# Altium schematic sheet Connectors.SchDoc
size A4; DocumentNumber: 3; SheetNumber: 3; SheetTotal: 7
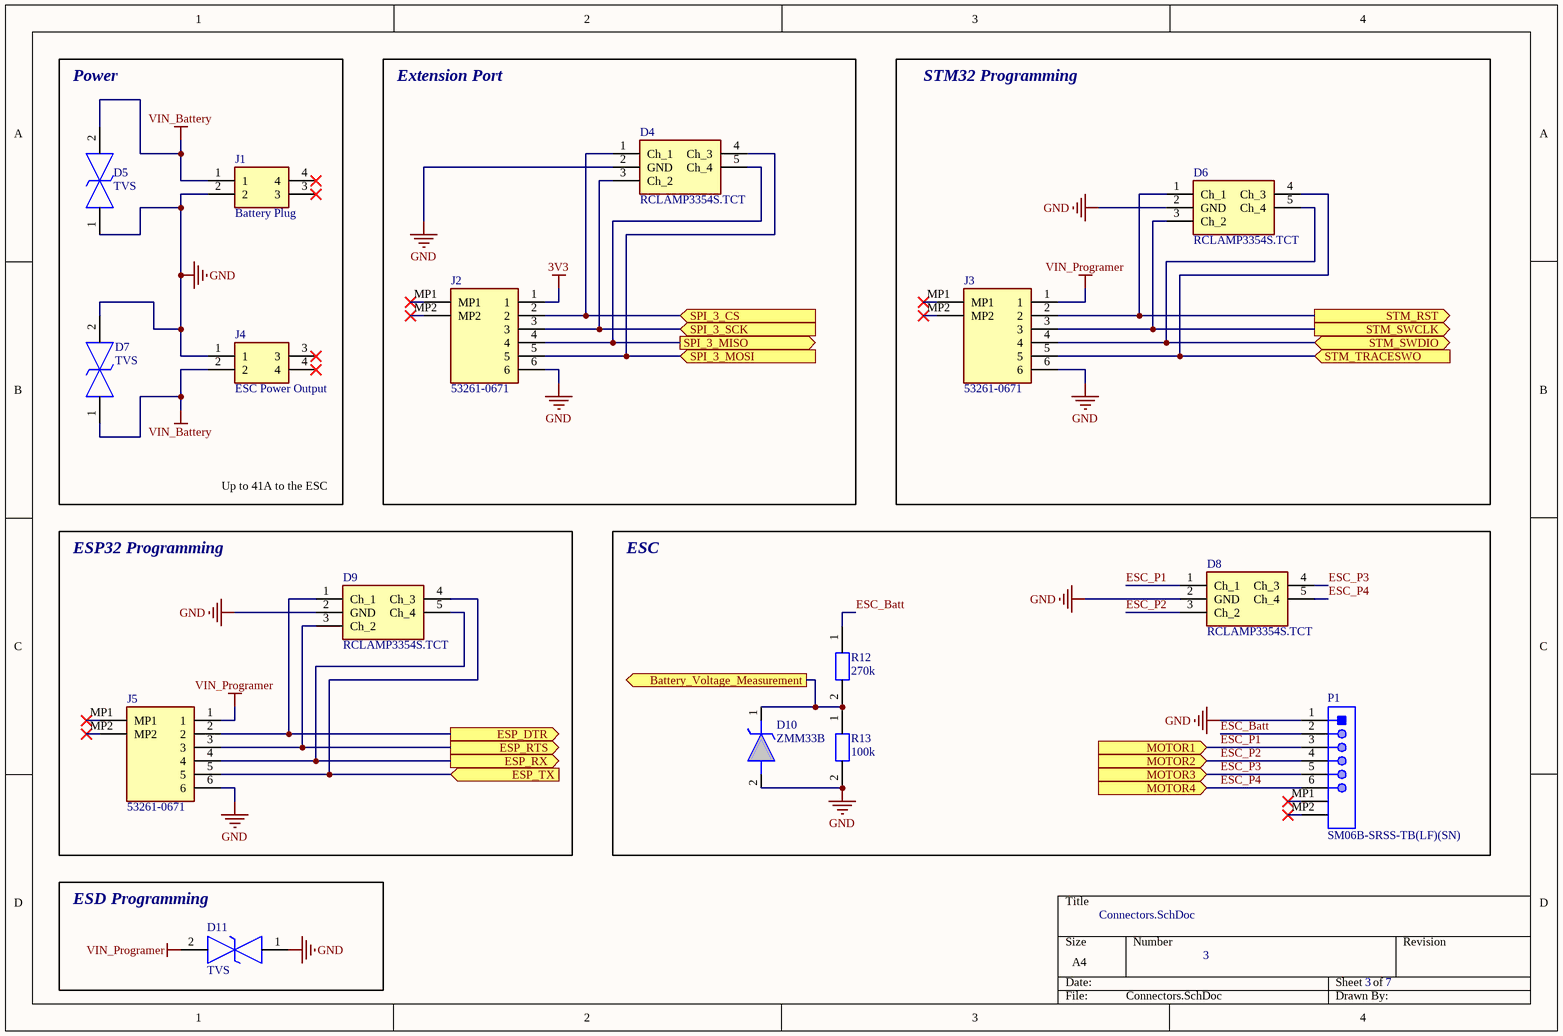
[diagram p0: Connectors.SchDoc]

## Parts
D4  RCLAMP3354S.TCT  [SOT95P280X145-5N]
D5  TVS  [DIONM5127X250N]
D6  RCLAMP3354S.TCT  [SOT95P280X145-5N]
D7  TVS  [DIONM5127X250N]
D8  RCLAMP3354S.TCT  [SOT95P280X145-5N]
D9  RCLAMP3354S.TCT  [SOT95P280X145-5N]
D10  ZMM33B  [ZMM33B]
D11  TVS  [AQ120501LTG]
J1  Battery Plug  [XT30PWM]
J2  53261-0671  [532610671]
J3  53261-0671  [532610671]
J4  ESC Power Output  [XT30PWF]
J5  53261-0671  [532610671]
P1  SM06B-SRSS-TB(LF)(SN)  [JST-SM06B-SRSS-TB_V]
R12  270k  [Res_0603_Medium_Density]
R13  100k  [Res_0603_Medium_Density]

## Blocks framed on the sheet
Power: D5 D7 J1 J4
Extension Port: D4 J2
STM32 Programming: D6 J3
ESP32 Programming: D9 J5
ESC: D8 D10 P1 R12 R13
ESD Programming: D11

## Ports
Battery_Voltage_Measurement (out), ESP_DTR (out), ESP_RTS (out), ESP_RX (out), ESP_TX (in), MOTOR1 (in), MOTOR2 (in), MOTOR3 (in), MOTOR4 (in), SPI_3_CS (in), SPI_3_MISO (out), SPI_3_MOSI (in), SPI_3_SCK (in), STM_RST (out), STM_SWCLK (out), STM_SWDIO (bidir), STM_TRACESWO (in)

## Nets
3V3: J2.1
GND: D4.2(GND) D5.1 D6.2(GND) D7.2 D8.2(GND) D9.2(GND) D10.2(A) D11.1 J1.2 J2.6 J3.6 J4.1 J5.6 P1.1 R13.2
VIN_Battery: D5.2 D7.1 J1.1 J4.2
VIN_Programer: D11.2 J3.1 J5.1
Battery_Voltage_Measurement: D10.1(K) R12.2 R13.1 ; port Battery_Voltage_Measurement
ESC_Batt: P1.2 R12.1
ESC_P1: D8.1(Ch_1) P1.3 ; port MOTOR1
ESC_P2: D8.3(Ch_2) P1.4 ; port MOTOR2
ESC_P3: D8.4(Ch_3) P1.5 ; port MOTOR3
ESC_P4: D8.5(Ch_4) P1.6 ; port MOTOR4
ESP_DTR: D9.1(Ch_1) J5.2 ; port ESP_DTR
ESP_RTS: D9.3(Ch_2) J5.3 ; port ESP_RTS
ESP_RX: D9.5(Ch_4) J5.4 ; port ESP_RX
ESP_TX: D9.4(Ch_3) J5.5 ; port ESP_TX
SPI_3_CS: D4.1(Ch_1) J2.2 ; port SPI_3_CS
SPI_3_MISO: D4.5(Ch_4) J2.4 ; port SPI_3_MISO
SPI_3_MOSI: D4.4(Ch_3) J2.5 ; port SPI_3_MOSI
SPI_3_SCK: D4.3(Ch_2) J2.3 ; port SPI_3_SCK
STM_RST: D6.1(Ch_1) J3.2 ; port STM_RST
STM_SWCLK: D6.3(Ch_2) J3.3 ; port STM_SWCLK
STM_SWDIO: D6.5(Ch_4) J3.4 ; port STM_SWDIO
STM_TRACESWO: D6.4(Ch_3) J3.5 ; port STM_TRACESWO

Not connected (* = marked no-connect by the designer): J1 3* 4*; J2 MP1* MP2*; J3 MP1* MP2*; J4 3* 4*; J5 MP1* MP2*; P1 MP1* MP2*

## Notes on the sheet
- Up to 41A to the ESC

## Library data of the parts
D4 D6 D8 D9 = RCLAMP3354S.TCT: ESD Suppressors / TVS Diodes 3.3V 4 LINE LOW CAP; Manufacturer_Name: SEMTECH; Geometry.Height: 1.45mm; Manufacturer_Part_Number: RCLAMP3354S.TCT; Mouser Part Number: 947-RCLAMP3354S.TCT; Mouser Price/Stock: https://www.mouser.co.uk/ProductDetail/Semtech/RCLAMP3354S.TCT?qs=rBWM4%252BvDhIcjyMg1J9MbMw%3D%3D; Datasheet Link: https://semtech.my.salesforce.com/sfc/p/#E0000000JelG/a/44000000MCrm/q3IJaquvh9BkANCL4E8HYT8vxS.k3jwPHRhsWr6XNsI; Part Number: RCLAMP3354S.TCT; Supplier: Mouser
D5 D7 = SMAJ12CA-HP6AT_13: 19.9V Clamp 30.2A Ipp Tvs Diode Surface Mount DO-214AC (SMA); Manufacturer_Name: YAGEO; Manufacturer_Part_Number: SMAJ12CA-HP6AT/13; Geometry.Height: 2.5mm; Mouser Part Number: *; Mouser Price/Stock: *; Datasheet Link: https://www.yageo.com/upload/media/product/productsearch/datasheet/cpc/tvs/SMAJ-HP6AT_1.pdf; Part Number: SMAJ12CA-HP6AT/13; Supplier: Mouser
D10 = ZMM33B: SMD Planra Zener Diode; Manufacturer_Name: Diotec; Geometry.Height: 1.45mm; Manufacturer_Part_Number: ZMM33B; Mouser Part Number: 637-ZMM33B; Mouser Price/Stock: https://www.mouser.co.uk/ProductDetail/Diotec-Semiconductor/ZMM33B?qs=OlC7AqGiEDlS5hTI7j6ASg%3D%3D; Datasheet Link: *; Part Number: ZMM33B; Supplier: Mouser
D11 = AQ1205-01LTG: 7pF, 7A, SOD523, Bidirectional Discrete TVS Diode, General Purpose ESD Protection; Manufacturer_Name: LITTELFUSE; Geometry.Height: 0.77mm; Manufacturer_Part_Number: AQ1205-01LTG; Mouser Part Number: *; Mouser Price/Stock: *; Datasheet Link: https://www.littelfuse.com/assetdocs/littelfuse-tvs-diode-array-aq1205-01ltg-datashee?assetguid=bd1b547a-f82e-4cfc-8f41-242773d1850e; Part Number: AQ1205-01LTG; Supplier: Mouser
J1 = XT30PW-M: 30A Low Temperature Rise Fire Retardant Plug; Manufacturer_Name: Amass; Geometry.Height: 5mm; Manufacturer_Part_Number: XT30PW-M; Mouser Part Number: *; Mouser Price/Stock: *; Datasheet Link: https://www.tme.eu/sl/Document/ce4077e36b79046da520ca73227e15de/XT30PW%20SPEC.pdf; Part Number: XT30PW-M
J2 J3 J5 = 53261-0671: 1.25mm Pitch, PicoBlade PCB Header, Single Row, Right-Angle, Surface Mount, Tin (Sn) Plating, Friction Lock,  Circuits, Tape and Reel; Manufacturer_Name: Molex; Geometry.Height: 3.6mm; Manufacturer_Part_Number: 53261-0671; Mouser Part Number: 538-53261-0671; Mouser Price/Stock: https://www.mouser.co.uk/ProductDetail/Molex/53261-0671?qs=%252B72YyncTwW9Wyr77z4J2cA%3D%3D; Datasheet Link: https://www.molex.com/pdm_docs/sd/532610671_sd.pdf; Part Number: 53261-0671; Supplier: Mouser
J4 = XT30PW-F: Socket; DC supply; XT30; female; PIN:2; on PCBs; THT; Colour: yellow; Manufacturer_Name: Amass; Geometry.Height: 5mm; Manufacturer_Part_Number: XT30PW-F; Mouser Part Number: *; Mouser Price/Stock: *; Datasheet Link: https://www.tme.eu/Document/ce4077e36b79046da520ca73227e15de/XT30PW%20SPEC.pdf; Part Number: XT30PW-F
P1 = CMP-2000-07080-1: Male Header, Pitch 1 mm, 1 x 6 Position, Height 2.95 mm, -25 to 85 degC, RoHS, Tape and Reel; Manufacturer: JST; No of Positions: 6; Pitch: 1mm; Style/Orientation: RightAngleHeader/Plug; Datasheet URL: https://datasheet.ciiva.com/26894/getdatasheetpartid-708885-26894671.pdf; Package Description: Male Header, Pitch 1 mm, 1 X 6 Position, Height 2.9 mm; Termination: Solder; Manufacturer URL: http://www.jst.com/home2.html; Type: ShroudedHeader; Package Reference: SM06B-SRSS-TB; Datasheet Version: 11/2010; Mounting Technology: SurfaceMount; Manufacturer_Name: JST; Part Number: SM06B-SRSS-TB(LF)(SN); Supplier: Mouser
R12 = Resistor_SMD: Part Number: CR0603-JW-274ELF; Value: 270k; Manufacturer: *; Supplier: Mouser; Voltage: *; ComponentLink1Description: Online Store Link; ComponentLink1URL: *; Package: 0603
R13 = Resistor_SMD: Part Number: AF0603FR-13100KL; Value: 100k; Manufacturer: *; Supplier: Mouser; Voltage: *; ComponentLink1Description: Online Store Link; ComponentLink1URL: *; Package: 0603